# Altium schematic sheet Top Sheet.SchDoc: MIDI-CV Converter: Backplane Connector
size Letter; Engineer: Nicholas Morrow; DocumentNumber: 1; SheetNumber: 1; SheetTotal: 5; Project: GARY Synthesizer
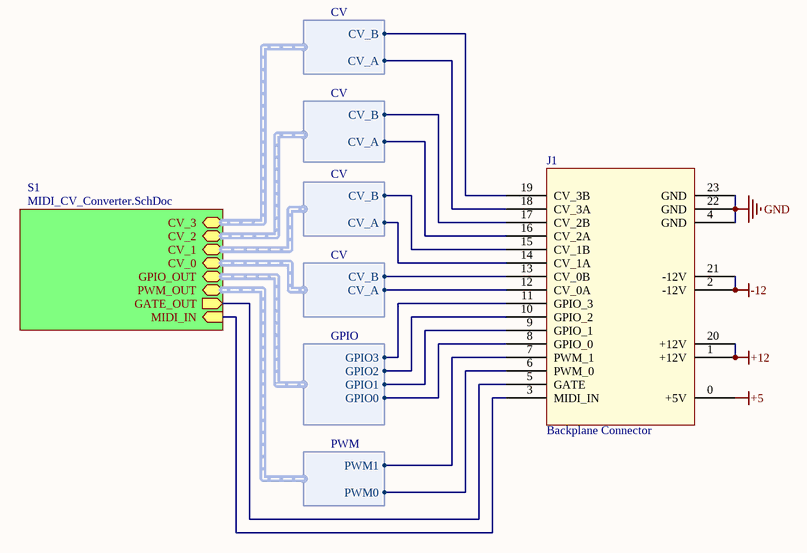
[diagram p0: Top Sheet.SchDoc]

## Parts
J1  Backplane Connector  [MIDI-CV CONVERTER MODULE]

## Sub-sheets
S1 = MIDI_CV_Converter.SchDoc: MIDI_IN (in), CV_0 (harness CV), CV_1 (harness CV), CV_2 (harness CV), CV_3 (harness CV), PWM_OUT (harness PWM), GPIO_OUT (harness GPIO), GATE_OUT (out)

## Harnesses
CV: CV_B, CV_A
PWM: PWM0, PWM1
GPIO: GPIO0, GPIO1, GPIO2, GPIO3

## Nets
+5: J1.0(+5V)
+12: J1.1(+12V) J1.20(+12V)
-12: J1.2(-12V) J1.21(-12V)
GND: J1.4(GND) J1.22(GND) J1.23(GND)
NetJ1_3: J1.3(MIDI_IN) ; sheet S1/MIDI_IN
NetJ1_5: J1.5(GATE) ; sheet S1/GATE_OUT
NetJ1_6: J1.6(PWM_0) ; sheet S1/PWM_OUT.PWM0
NetJ1_7: J1.7(PWM_1) ; sheet S1/PWM_OUT.PWM1
NetJ1_8: J1.8(GPIO_0) ; sheet S1/GPIO_OUT.GPIO0
NetJ1_9: J1.9(GPIO_1) ; sheet S1/GPIO_OUT.GPIO1
NetJ1_10: J1.10(GPIO_2) ; sheet S1/GPIO_OUT.GPIO2
NetJ1_11: J1.11(GPIO_3) ; sheet S1/GPIO_OUT.GPIO3
NetJ1_12: J1.12(CV_0A) ; sheet S1/CV_0.CV_A
NetJ1_13: J1.13(CV_0B) ; sheet S1/CV_0.CV_B
NetJ1_14: J1.14(CV_1A) ; sheet S1/CV_1.CV_A
NetJ1_15: J1.15(CV_1B) ; sheet S1/CV_1.CV_B
NetJ1_16: J1.16(CV_2A) ; sheet S1/CV_2.CV_A
NetJ1_17: J1.17(CV_2B) ; sheet S1/CV_2.CV_B
NetJ1_18: J1.18(CV_3A) ; sheet S1/CV_3.CV_A
NetJ1_19: J1.19(CV_3B) ; sheet S1/CV_3.CV_B

## Notes on the sheet
- Notes:
- Title:
- Size:
- Project:
- Letter
- Number:
- Revision:
- Date:
- Engineer:
- Sheet:
- of

## Library data of the parts
J1 = MIDI_CV_Converter